# EAGLE design AudioAppBoard-0BAC0603 (EAGLE 5.10)
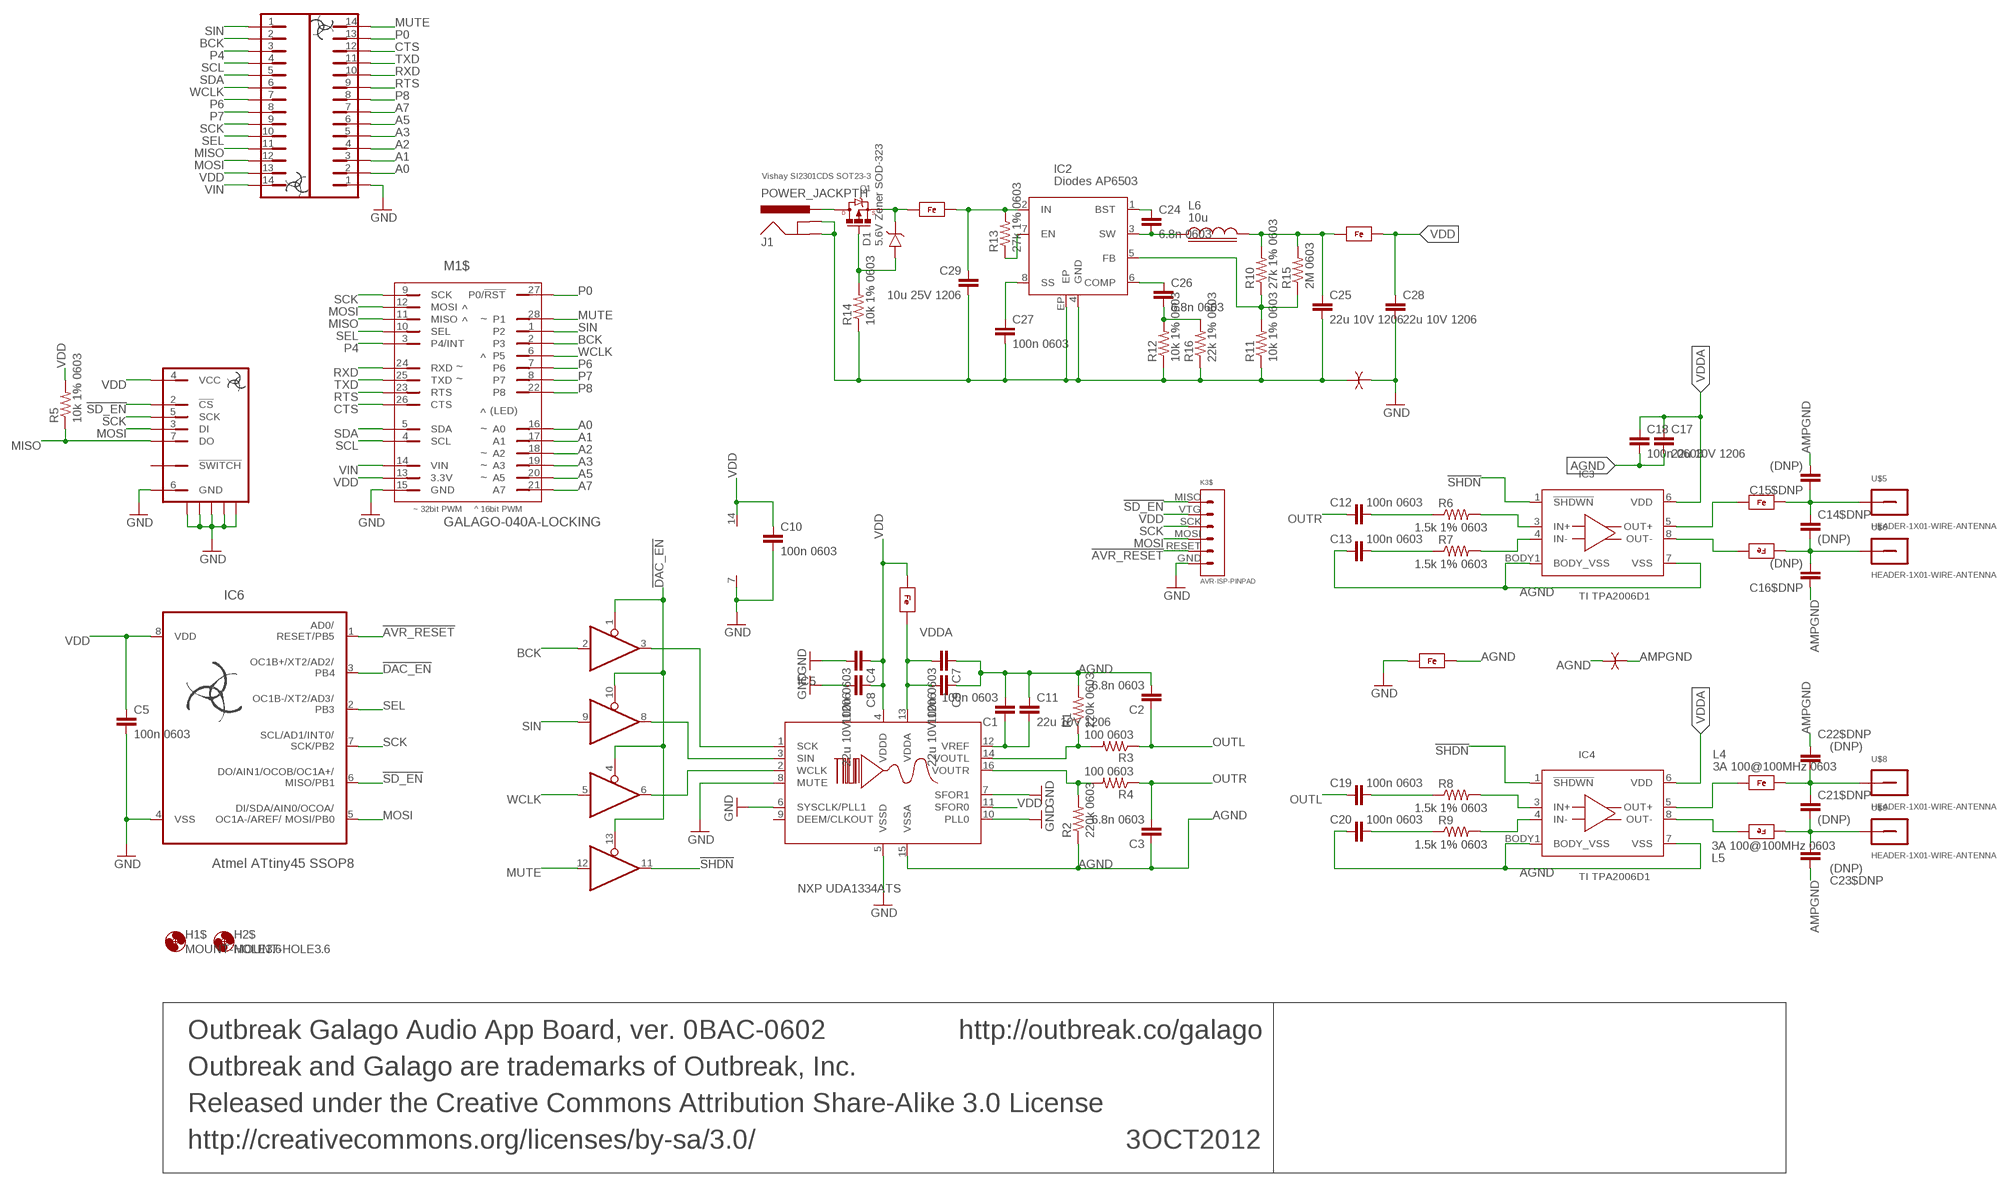
[diagram p0: schematic, sheet 1]

## Parts
3OCT2012  Outbreak Galago Audio App Board, ver. 0BAC-0602  INFO-BLOCK  [INFO-BLOCK]
C1  100n 0603  CAP-0603  [0603]
C2  6.8n 0603  CAP-0603  [0603]
C3  6.8n 0603  CAP-0603  [0603]
C4  100n 0603  CAP-0603  [0603]
C5  100n 0603  CAP-0603  [0603]
C7  100n 0603  CAP-0603  [0603]
C8  22u 10V 1206  CAP-1206  [1206]
C9  22u 10V 1206  CAP-1206  [1206]
C10  100n 0603  CAP-0603  [0603]
C11  22u 10V 1206  CAP-1206  [1206]
C12  100n 0603  CAP-0603-MIN  [0603-MIN]
C13  100n 0603  CAP-0603-MIN  [0603-MIN]
C14$DNP  (DNP)  CAP-0603-MIN  [0603-MIN]
C15$DNP  (DNP)  CAP-0603-MIN  [0603-MIN]
C16$DNP  (DNP)  CAP-0603-MIN  [0603-MIN]
C17  22u 10V 1206  CAP-1206  [1206]
C18  100n 0603  CAP-0603-MIN  [0603-MIN]
C19  100n 0603  CAP-0603-MIN  [0603-MIN]
C20  100n 0603  CAP-0603-MIN  [0603-MIN]
C21$DNP  (DNP)  CAP-0603-MIN  [0603-MIN]
C22$DNP  (DNP)  CAP-0603-MIN  [0603-MIN]
C23$DNP  (DNP)  CAP-0603-MIN  [0603-MIN]
C24  6.8n 0603  CAP-0603-MIN  [0603-MIN]
C25  22u 10V 1206  CAP-1206  [1206]
C26  6.8n 0603  CAP-0603-MIN  [0603-MIN]
C27  100n 0603  CAP-0603-MIN  [0603-MIN]
C28  22u 10V 1206  CAP-1206  [1206]
C29  10u 25V 1206  CAP-1206  [1206]
D1  5.6V Zener SOD-323  DIODE-ZENER-SOD323  [SOD-323]
FB1  3A 100@100MHz 0603  FERRITE-BEAD-0603-MIN  [0603-MIN]
FB2  3A 100@100MHz 0603  FERRITE-BEAD-0603  [0603]
FB3  800mA 60@100MHz 0603  FERRITE-BEAD-0603  [0603]
H1$  MOUNT-HOLE3.6  [3,6]
H2$  MOUNT-HOLE3.6  [3,6]
IC1  74HC125-TSSOP14  [TSSOP14]
IC2  Diodes AP6503  SWITCHING-REGULATOR-VARIABLE-BUCK-DIODES-AP6503  [EIAJ-SOIC8-3.9MM-EXPOSED-PAD]
IC3  TI TPA2006D1  AMP-AUDIO-CLASS-D-TI-TPA2006A  [QFN8-3X3MM-TI-TPA200X]
IC4  TI TPA2006D1  AMP-AUDIO-CLASS-D-TI-TPA2006A  [QFN8-3X3MM-TI-TPA200X]
IC5  NXP UDA1334ATS  AUDIO-DAC-NXP-UDA1334ATS  [TSSOP16]
IC6  Atmel ATtiny45 SSOP8  AVR-ATTINY25/45/85-TSSOP8  [TSSOP8]
J1  POWER_JACKPTH  [POWER_JACK_PTH]
K1$  HEADER-1X14-NO-SILK-CHUNKY  [HEADER-1X14-NO-SILK-CHUNKY]
K2$  HEADER-1X14-NO-SILK-CHUNKY  [HEADER-1X14-NO-SILK-CHUNKY]
K3$  AVR-ISP-PINPAD  [AVR-ISP-PINPAD]
L2  3A 100@100MHz 0603  FERRITE-BEAD-0603-MIN  [0603-MIN]
L3  3A 100@100MHz 0603  FERRITE-BEAD-0603-MIN  [0603-MIN]
L4  3A 100@100MHz 0603  FERRITE-BEAD-0603-MIN  [0603-MIN]
L5  3A 100@100MHz 0603  FERRITE-BEAD-0603-MIN  [0603-MIN]
L6  10u  INDUCTOR-6X6MM  [INDUCTOR-SMD-6X6MM]
L7  3A 100@100MHz 0603  FERRITE-BEAD-0603-MIN  [0603-MIN]
M1$  GALAGO-040A-LOCKING  [GALAGO-LOCKING]
Q1  Vishay SI2301CDS SOT23-3  MOSFET-P-CHANNEL-VISHAY-SI2301  [SOT23-3]
R1  220k 0603  RESISTOR-0603  [0603]
R2  220k 0603  RESISTOR-0603  [0603]
R3  100 0603  RESISTOR-0603  [0603]
R4  100 0603  RESISTOR-0603  [0603]
R5  10k 1% 0603  RESISTOR-0603-MIN  [0603-MIN]
R6  1.5k 1% 0603  RESISTOR-0603-MIN  [0603-MIN]
R7  1.5k 1% 0603  RESISTOR-0603-MIN  [0603-MIN]
R8  1.5k 1% 0603  RESISTOR-0603-MIN  [0603-MIN]
R9  1.5k 1% 0603  RESISTOR-0603-MIN  [0603-MIN]
R10  27k 1% 0603  RESISTOR-0603-MIN  [0603-MIN]
R11  10k 1% 0603  RESISTOR-0603-MIN  [0603-MIN]
R12  10k 1% 0603  RESISTOR-0603-MIN  [0603-MIN]
R13  27k 1% 0603  RESISTOR-0603-MIN  [0603-MIN]
R14  10k 1% 0603  RESISTOR-0603-MIN  [0603-MIN]
R15  2M 0603  RESISTOR-0603-MIN  [0603-MIN]
R16  22k 1% 0603  RESISTOR-0603-MIN  [0603-MIN]
U1$  GND-ISOLATOR-0.008"  [GND-ISOLATOR-0.008"]
U2$  GND-ISOLATOR-0.008"  [GND-ISOLATOR-0.008"]
U$2  SD-OR-MICROSD-SPI-MODE-WITH-SWITCH-HIROSE-DM3D-SF  [HIROSE-MICROSD-SOCKET-DM3D-SF]
U$5  HEADER-1X01-WIRE-ANTENNA  [HEADER-1X01-WIRE-ANTENNA]
U$6  HEADER-1X01-WIRE-ANTENNA  [HEADER-1X01-WIRE-ANTENNA]
U$8  HEADER-1X01-WIRE-ANTENNA  [HEADER-1X01-WIRE-ANTENNA]
U$9  HEADER-1X01-WIRE-ANTENNA  [HEADER-1X01-WIRE-ANTENNA]

## Nets
!AVR_RESET: IC6.1(RESET/PB5) K3$.RESET
!DAC_EN: IC1.1(EN) IC1.4(EN) IC1.10(EN) IC1.13(EN) IC6.3(PB4)
!SD_EN: IC6.6(MISO/PB1) K3$.MISO U$2.2(!CS)
!SHDN: IC1.11(Y) IC3.1(!SHDWN) IC4.1(!SHDWN)
A0: K1$.2 M1$.16(A0)
A1: K1$.3 M1$.17(A1)
A2: K1$.4 M1$.18(A2)
A3: K1$.5 M1$.19(A3)
A5: K1$.6 M1$.20(A5)
A7: K1$.7 M1$.21(A7)
AGND: C1.1 C2.1 C3.2 C7.2 C9.2 C11.2 C13.2 C17.1 C18.1 C20.2 IC3.7(VSS) IC3.BODY1(BODY_VSS) IC4.7(VSS) IC4.BODY1(BODY_VSS) IC5.15(VSSA) L7.2 R1.2 R2.1 U2$.1(A)
AMPGND: C15$DNP.1 C16$DNP.2 C22$DNP.1 C23$DNP.2 U2$.2(B)
BCK: IC1.2(A) K2$.2 M1$.2(P3)
CTS: K1$.12 M1$.26(CTS)
DAC_SCK: IC1.3(Y) IC5.1(SCK)
DAC_SIN: IC1.8(Y) IC5.3(SIN)
DAC_WCLK: IC1.6(Y) IC5.2(WCLK)
GND: C4.1 C5.1 C8.1 C10.1 C28.1 IC1.7(VSS) IC5.5(VSSD) IC5.6(SYSCLK/PLL1) IC5.7(SFOR1) IC5.8(MUTE) IC5.10(PLL0) IC6.4(VSS) K1$.1 K3$.GND L7.1 M1$.15(GND) U1$.2(B) U$2.6(GND) U$2.PP$1 U$2.PP$2 U$2.PP$3 U$2.PP$4 U$2.PP$5
MISO: K2$.11 M1$.11(MISO) R5.1 U$2.7(DO)
MOSI: IC6.5(MOSI/PB0) K2$.12 K3$.MOSI M1$.12(MOSI) U$2.3(DI)
MUTE: IC1.12(A) K1$.14 M1$.28(P1)
N$1: C14$DNP.2 C15$DNP.2 L2.2 U$5.1
N$2: IC4.5(OUT+) L4.1
N$3: IC3.5(OUT+) L2.1
N$4: IC3.8(OUT-) L3.2
N$5: C12.1 R6.1
N$6: D1.A Q1.1(GATE) R14.2
N$7: C13.1 R7.1
N$8: IC3.4(IN-) R7.2
N$9: IC3.3(IN+) R6.2
N$10: C14$DNP.1 C16$DNP.1 L3.1 U$6.1
N$11: IC4.8(OUT-) L5.2
N$12: C19.1 R8.1
N$13: C20.1 R9.1
N$14: IC4.4(IN-) R9.2
N$15: IC4.3(IN+) R8.2
N$18: C21$DNP.2 C22$DNP.2 L4.2 U$8.1
N$19: C21$DNP.1 C23$DNP.1 L5.1 U$9.1
N$23: D1.K FB1.1 Q1.2(SOURCE)
N$27: C26.1 R12.2 R16.2
N$31: J1.PWR Q1.3(DRAIN)
OUTL: C2.2 C19.2 R3.1
OUTR: C3.1 C12.2 R4.1
P0: K1$.13 M1$.27(P0/!RST)
P4: K2$.3 M1$.3(P4/INT)
P6: K2$.7 M1$.7(P6)
P7: K2$.8 M1$.8(P7)
P8: K1$.8 M1$.22(P8)
RTS: K1$.9 M1$.23(RTS)
RXD: K1$.10 M1$.24(RXD)
SCK: IC6.7(SCK/PB2) K2$.9 K3$.SCK M1$.9(SCK) U$2.5(SCK)
SCL: K2$.4 M1$.4(SCL)
SDA: K2$.5 M1$.5(SDA)
SEL: IC6.2(PB3) K2$.10 M1$.10(SEL)
SIN: IC1.9(A) K2$.1 M1$.1(P2)
SMPS-BST: C24.2 IC2.1(BST)
SMPS-COMP: C26.2 IC2.6(COMP)
SMPS-EN: IC2.7(EN) R13.1
SMPS-FB: IC2.5(FB) R10.1 R11.2 R15.1
SMPS-GND: C25.1 C27.1 C29.1 IC2.4(GND) IC2.EP J1.GND J1.GNDBREAK R11.1 R12.1 R14.1 R16.1 U1$.1(A)
SMPS-IN: C29.2 FB1.2 IC2.2(IN) R13.2
SMPS-OUT: C25.2 FB2.1 L6.2 R10.2 R15.2
SMPS-SS: C27.2 IC2.8(SS)
SMPS-SW: C24.1 IC2.3(SW) L6.1
TXD: K1$.11 M1$.25(TXD)
VDD: C4.2 C5.2 C8.2 C10.2 C28.2 FB2.2 FB3.1 IC1.14(VDD) IC5.4(VDDD) IC5.11(SFOR0) IC6.8(VDD) K2$.13 K3$.VTG M1$.13(3.3V) R5.2 U$2.4(VCC)
VDDA: C7.1 C9.1 C17.2 C18.2 FB3.2 IC3.6(VDD) IC4.6(VDD) IC5.13(VDDA)
VIN: K2$.14 M1$.14(VIN)
VOUTL: IC5.14(VOUTL) R1.1 R3.2
VOUTR: IC5.16(VOUTR) R2.2 R4.2
VREF: C1.2 C11.1 IC5.12(VREF)
WCLK: IC1.5(A) K2$.6 M1$.6(P5)
Unconnected: IC5.9(DEEM/CLKOUT) U$2.SWITCH(!SWITCH)

## Library data of the parts
3OCT2012 = Outbreak:INFO-BLOCK
C1-C5 C7-C13 C14$DNP C15$DNP C16$DNP C17-C20 C21$DNP C22$DNP C23$DNP C24-C29 = Outbreak:CAP
D1 = Outbreak:DIODE-ZENER
FB1-FB3 L2-L5 L7 = Outbreak:FERRITE-BEAD
H1$ H2$ = holes:MOUNT-HOLE: MOUNTING HOLE with drill center marker
IC1 = Outbreak:74HC125
IC2 = Outbreak:SWITCHING-REGULATOR-VARIABLE-BUCK-DIODES-AP6503
IC3 IC4 = Outbreak:AMP-AUDIO-CLASS-D-TI-TPA2006A
IC5 = Outbreak:AUDIO-DAC-NXP-UDA1334ATS
IC6 = Outbreak:AVR-ATTINY25/45/85
J1 = SparkFun:POWER_JACK: Power Jack This is the standard 5.5mm barrel jack for power. The PTH is the most common, proven, reliable, footprint. All others are experimental. The Slot footprint only works if the mill layer is transmitted to the PCB fab house so be warned. Spark Fun Electronics SKU : PRT-00119. Mating wall wart : TOL-00298 (and others)
K1$ K2$ = Outbreak:HEADER-1X14-NO-SILK
K3$ = Outbreak:AVR-ISP-PINPAD
L6 = Outbreak:INDUCTOR
M1$ = Outbreak-v0:GALAGO-040A
Q1 = Outbreak:MOSFET-P-CHANNEL
R1-R16 = Outbreak:RESISTOR: Resistor Basic schematic elements and footprints for 0603, 1206, and PTH resistors.
U1$ U2$ = Outbreak:GND-ISOLATOR
U$2 = Outbreak:SD-OR-MICROSD-SPI-MODE-WITH-SWITCH
U$5 U$6 U$8 U$9 = Outbreak:HEADER-1X01

## Board
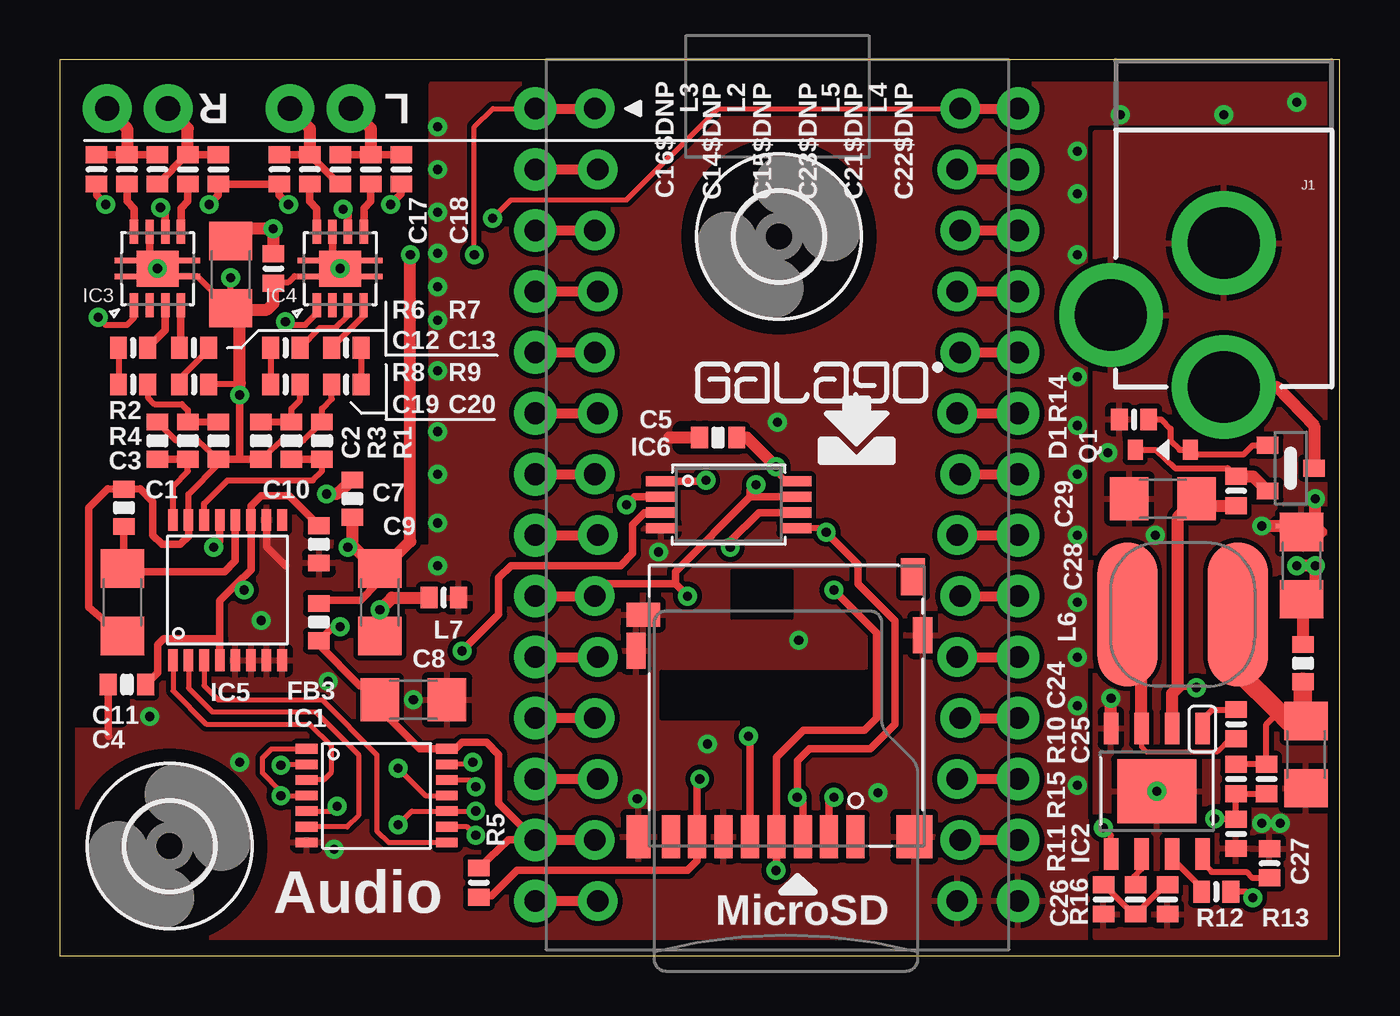
[diagram p1: board, top side]
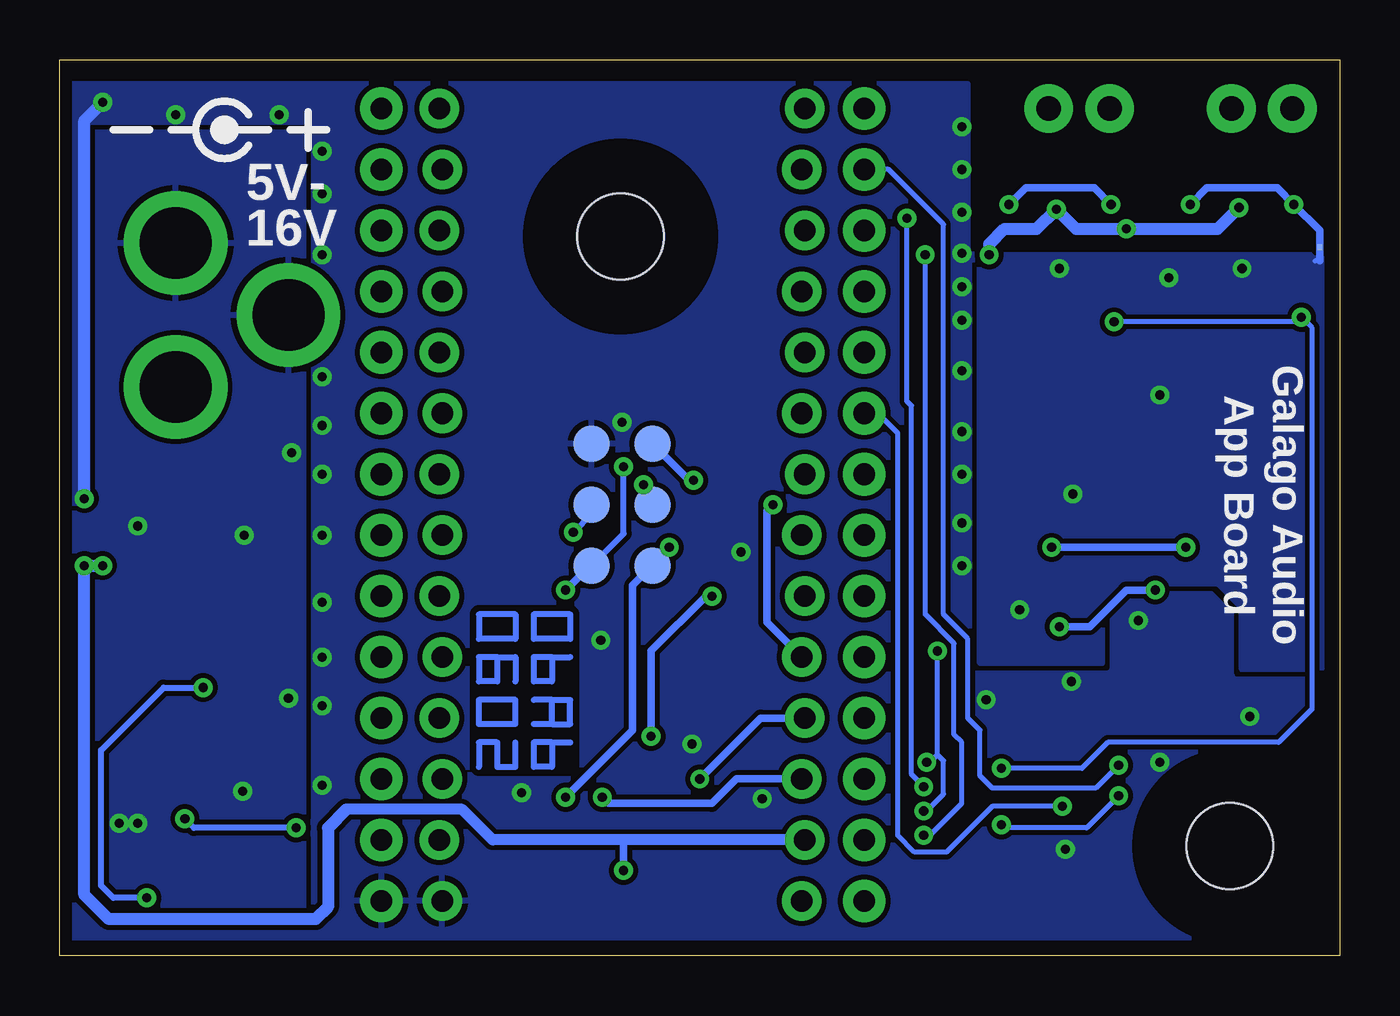
[diagram p2: board, bottom side, seen from below]

Size 53.34 x 37.33 mm. Coordinates in mm from the lower left corner, seen from the top.
Outline: 0,0 53.34,0 53.34,37.33 0,37.33 0,0
Copper layers (1*16): Top 0.035mm / dielectric 1.5mm / Bottom 0.035mm
Design rules "default *": minimum track width 8mil, minimum drill 15mil, track to track 8mil, track to pad 8mil, pad to pad 8mil, via to via 8mil, smd to smd 8mil, copper to edge 20mil, drill to drill 8mil, minimum pad ring 10mil, minimum via ring 8mil, stop-mask expansion 4mil, vias tented up to drill 20mil, thermal gap 10mil
tRestrict: area 25.9,21.3 to 28.3,21.9; area 0.5,9.9 to 2.5,11.7
bRestrict: area 32.1,7.9 to 35.9,14.2

### Footprints (pad centres in the part's own frame; a part is rotated, then mirrored left to right if it is on the bottom)
0603 = smd 0.7 x 0.9: 1 -0.777,0; 2 0.777,0
1206 = smd 1.6 x 1.8: 1 -1.4,0; 2 1.4,0
0603-MIN = smd 0.7 x 0.9: 1 -0.61,0; 2 0.61,0
SOD-323 = smd 0.63 x 0.83: A -1.15,0; K 1.15,0
3,6 = hole 3.6: 0,0
TSSOP14 = smd 0.4 x 0.9: 1 2.275,2.925; 2 1.625,2.925; 3 0.975,2.925; 4 0.325,2.925; 5 -0.325,2.925; 6 -0.975,2.925; 7 -1.625,2.925; 8 -1.625,-2.925; 9 -0.975,-2.925; 10 -0.325,-2.925; 11 0.325,-2.925; 12 0.975,-2.925; 13 1.625,-2.925; 14 2.275,-2.925
EIAJ-SOIC8-3.9MM-EXPOSED-PAD = smd 1.321 x 0.61: 1 -2.618,1.905; 2 -2.618,0.635; 3 -2.618,-0.635; 4 -2.618,-1.905; 5 2.618,-1.905; 6 2.618,-0.635; 7 2.618,0.635; 8 2.618,1.905 | smd 2.66 x 3.3: EP 0,0
QFN8-3X3MM-TI-TPA200X = smd 0.35 x 1: 1 0.975,1.525; 2 0.325,1.525; 3 -0.325,1.525; 4 -0.975,1.525; 5 -0.985,-1.525; 6 -0.325,-1.525; 7 0.325,-1.525; 8 0.975,-1.525 | smd 1.75 x 1.5: BODY1 0,0 | smd 0.9 x 0.23: BODY2 -1.325,0.325; BODY3 -1.325,-0.325; BODY4 1.325,-0.325; BODY5 1.325,0.325
TSSOP16 = smd 0.4 x 0.9: 1 2.275,2.925; 2 1.625,2.925; 3 0.975,2.925; 4 0.325,2.925; 5 -0.325,2.925; 6 -0.975,2.925; 7 -1.625,2.925; 8 -2.275,2.925; 9 -2.275,-2.925; 10 -1.625,-2.925; 11 -0.975,-2.925; 12 -0.325,-2.925; 13 0.325,-2.925; 14 0.975,-2.925; 15 1.625,-2.925; 16 2.275,-2.925
TSSOP8 = smd 1.25 x 0.42: 1 -2.825,0.975; 2 -2.825,0.325; 3 -2.825,-0.325; 4 -2.825,-0.975; 5 2.825,-0.975; 6 2.825,-0.325; 7 2.825,0.325; 8 2.825,0.975
POWER_JACK_PTH = drill 2.997 pad 4.318 round: GND 0,7.7; GNDBREAK 4.7,10.7; PWR 0,13.7
HEADER-1X14-NO-SILK-CHUNKY = drill 0.9 pad 1.778 round: 1 0,0; 2 2.54,0; 3 5.08,0; 4 7.62,0; 5 10.16,0; 6 12.7,0; 7 15.24,0; 8 17.78,0; 9 20.32,0; 10 22.86,0; 11 25.4,0; 12 27.94,0; 13 30.48,0; 14 33.02,0
AVR-ISP-PINPAD = smd 1.524 x 1.524: GND 2.54,1.27; MISO -2.54,-1.27; MOSI 0,1.27; RESET 2.54,-1.27; SCK 0,-1.27; VTG -2.54,1.27
INDUCTOR-SMD-6X6MM = smd 2.5 x 6: 1 -2.3,0; 2 2.3,0
GALAGO-LOCKING = drill 0.9 pad 1.651 round: 1 -7.62,16.51; 2 -7.493,13.97; 3 -7.62,11.43; 4 -7.493,8.89; 5 -7.62,6.35; 6 -7.493,3.81; 7 -7.62,1.27; 8 -7.493,-1.27; 9 -7.62,-3.81; 10 -7.493,-6.35; 11 -7.62,-8.89; 12 -7.493,-11.43; 13 -7.62,-13.97; 14 -7.493,-16.51; 15 7.493,-16.51; 16 7.62,-13.97; 17 7.493,-11.43; 18 7.62,-8.89; 19 7.493,-6.35; 20 7.62,-3.81; 21 7.493,-1.27; 22 7.62,1.27; 23 7.493,3.81; 24 7.62,6.35; 25 7.493,8.89; 26 7.62,11.43; 27 7.493,13.97; 28 7.62,16.51
SOT23-3 = smd 0.7 x 0.9: 1 0.95,0.97; 2 -0.95,0.97; 3 0,-0.97
GND-ISOLATOR-0.008" = smd 0.203 x 0.203: 1 -0.025,0; 2 0.025,0
HIROSE-MICROSD-SOCKET-DM3D-SF = smd 0.75 x 1.8: 1 2.62,-4.18; 2 1.52,-4.18; 3 0.42,-4.18; 4 -0.68,-4.18; 5 -1.78,-4.18; 6 -2.88,-4.18; 7 -3.98,-4.18; 8 -5.08,-4.18 | smd 1.4 x 1: PP$1 -6.23,5.07 | smd 0.8 x 1.5: PP$2 -6.53,3.57; PP$5 5.42,4.22 | smd 1 x 1.8: PP$3 -6.43,-4.18 | smd 1.5 x 1.8: PP$4 5.07,-4.18 | smd 1 x 1.55: SWITCH 5.02,6.645
HEADER-1X01-WIRE-ANTENNA = drill 1.016 pad 2.032 round: 1 0,0

### Placement (x,y rotation side)
3OCT2012  6.1,-7.62 0 top  (outside the outline)
C1  2.67,18.67 270 top
C2  8.38,21.46 90 top
C3  6.6,21.46 270 top
C4  2.79,11.3 0 top
C5  27.43,21.59 0 top
C7  12.19,19.05 90 top
C8  14.73,10.67 180 top
C9  13.34,14.73 270 top
C10  10.79,17.14 90 top
C11  2.6,14.73 270 top
C12  3.05,23.81 0 top
C13  5.59,23.81 0 top
C14$DNP  4.06,32.77 270 top
C15$DNP  6.6,32.77 90 top
C16$DNP  1.52,32.77 270 top
C17  7.11,28.38 90 top
C18  8.89,28.64 90 top
C19  9.4,23.81 0 top
C20  11.94,23.81 180 top
C21$DNP  11.68,32.77 90 top
C22$DNP  14.22,32.77 90 top
C23$DNP  9.14,32.77 270 top
C24  49.02,9.65 90 top
C25  51.94,8.38 90 top
C26  44.83,2.35 90 top
C27  50.42,3.85 270 top
C28  51.75,16.26 270 top
C29  45.97,19.05 0 top
D1  45.97,21.08 180 top
FB1  49.02,19.37 270 top
FB2  51.82,12.19 90 top
FB3  10.79,13.91 90 top
H1$  29.97,29.97 0 top
H2$  4.57,4.57 0 top
IC1  13.21,6.35 90 top
IC2  45.72,6.86 270 top
IC3  4.06,28.64 180 top
IC4  11.68,28.64 180 top
IC5  6.99,15.24 180 top
IC6  27.88,18.8 0 top
J1  48.51,37.4 180 top
K1$  39.94,2.29 90 top
K2$  19.81,35.31 270 top
K3$  29.91,18.8 90 bottom
L2  5.33,32.77 90 top
L3  2.79,32.77 270 top
L4  12.95,32.77 90 top
L5  10.41,32.77 270 top
L6  46.8,14.22 0 top
L7  16,14.92 180 top
M1$  29.91,18.8 0 top
Q1  51.31,20.32 90 top
R1  10.92,21.46 90 top
R2  4.06,21.46 270 top
R3  9.65,21.46 270 top
R4  5.33,21.46 270 top
R5  17.46,3.05 90 top
R6  3.05,25.34 0 top
R7  5.59,25.34 180 top
R8  9.4,25.34 0 top
R9  11.94,25.34 180 top
R10  49.02,7.37 90 top
R11  49.02,5.08 90 top
R12  46.16,2.35 90 top
R13  48.2,2.67 0 top
R14  44.77,22.35 0 top
R15  50.29,7.37 90 top
R16  43.5,2.35 90 top
U1$  50.8,17.91 0 top
U2$  0.83,29.53 90 bottom
U$1  [GALAGO-LOGO]  31.43,23.88 0 top
U$2  30.54,9.14 0 top
U$3  [GALAGO-APP-BOARD-SYMBOL]  33.21,21.34 0 top
U$5  4.51,35.31 0 top
U$6  1.97,35.31 0 top
U$8  12.13,35.31 0 top
U$9  9.59,35.31 0 top

### Tracks (layer width: path | path; a pad name or v marks a point on that pad's centre or on a via)
!AVR_RESET  (via drill 0.38)
  Top 0.305: v26.92,19.81 26.88,19.77 IC6.1
  Bottom 0.305: K3$.RESET 27.11,19.81 v26.92,19.81
!DAC_EN  (via drill 0.38)
  Top 0.203: IC1.4 9.28,6.67 v9.21,6.67 9.21,6.86 8.45,7.62 8.45,8.26 8.82,8.62 IC1.1 | v17.34,6.03 17.33,6.03 IC1.10 14.66,6.03 v14.1,5.46 | IC1.13 17.12,7.97 v17.21,8.06
  Top 0.305: IC6.3 24.38,18.47 23.88,17.97 23.88,16.76 23.37,16.26 18.8,16.26 18.29,15.75 18.29,14.22 v16.76,12.7
  Bottom 0.203: v14.1,5.46 13.97,5.33 10.54,5.33 v9.21,6.67 | 16.76,8.38 v16.76,12.7 | 16.76,8.38 16.51,8.13 16.51,6.73 17.21,6.03 v17.34,6.03 | v17.21,8.06 17.08,8.06 16.76,8.38
!SD_EN  (via drill 0.38)
  Top 0.305: U$2.2 32.06,6.41 v32.26,6.6 | v27.94,17.02 27.94,17.27 29.14,18.47 IC6.6
  Bottom 0.305: v32.26,6.6 29.46,9.4 29.46,15.43 K3$.MISO 28.64,16.32 v27.94,17.02
!SHDN  (via drill 0.38)
  Top 0.203: IC1.11 15.23,6.67 v14.1,7.81
  Top 0.254: IC3.1 3.09,26.58 2.79,26.29 1.91,26.29 v1.59,26.61 | IC4.1 10.71,26.77 10.22,26.29 9.53,26.29 v9.4,26.42
  Bottom 0.203: v9.4,26.42 1.78,26.42 v1.59,26.61 1.14,26.16 1.14,10.29 2.54,8.89 9.65,8.89 10.73,7.81 v14.1,7.81
A0
  Top 0.406: M1$.16 K1$.2
A1
  Top 0.406: M1$.17 K1$.3
A2
  Top 0.406: M1$.18 K1$.4
A3
  Top 0.406: M1$.19 K1$.5
A5
  Top 0.406: M1$.20 K1$.6
A7
  Top 0.406: M1$.21 K1$.7
AGND  (via drill 0.38)
  Top 0.254: C2.1 9.23,21.46 10.14,21.46 R1.2 10.92,22.8 11.33,23.2 C20.2 | R2.1 4.84,21.46 5.75,21.46 C3.2 6.6,20.49 5.36,19.24 IC5.15 | C13.2 7.49,23.81 7.49,23.88 | IC3.BODY1 4.38,28.32 5.71,28.32 7.05,26.98 C17.1 | IC4.BODY1 11.37,28.32 9.78,28.32 9.53,28.07 8.89,28.07 C18.1 | 7.11,27.37 v7.11,28.26
  Top 0.305: IC3.7 3.74,28.96 IC3.BODY1 | IC4.7 11.36,28.96 IC4.BODY1 | C11.2 1.21,14.53 1.21,18.67 1.99,19.46 C1.1 3.34,19.46 3.87,18.92 3.87,17.53 4.25,17.14 5.02,17.14 5.36,17.49 IC5.15 | C3.2 7.49,20.69 | 7.49,20.69 C2.1 | 7.49,20.69 v7.49,23.37
  Top 0.508: C18.1 8.89,27.18 8.64,26.92 7.49,26.92 | C17.1 7.11,26.92 7.49,26.92 | v7.49,23.37 7.49,23.88 7.49,26.92 | v11.11,19.24 11.53,19.24 C7.2 | C9.2 v13.34,14.41 13.84,14.92 L7.2
  Bottom 0.203: 0.83,28.96 1.02,28.96
  Bottom 0.305: U2$.1 0.83,28.96
  other vias: 4.06,28.64 11.68,28.64
  pour Bottom: 0.76,29.21 0.76,11.94 4.06,11.94 4.06,14.48 5.08,15.49 8.89,15.49 9.91,14.48 9.91,12.19 14.99,12.19 14.99,29.21
AMPGND  (via drill 0.38)
  Top 0.305: v6.22,31.3 6.6,31.69 C15$DNP.1 C23$DNP.2 9.14,31.69 v9.53,31.3 | C16$DNP.2 1.52,31.69 v1.91,31.3 | C22$DNP.1 14.22,31.75 v13.78,31.3
  Bottom 0.203: v1.91,31.3 1.91,31.37
  Bottom 0.305: v6.22,31.3 5.52,32 2.6,32 v1.91,31.3 0.83,30.23 U2$.2 | v13.78,31.3 13.08,32 10.22,32 v9.53,31.3
BCK  (via drill 0.38)
  Top 0.203: IC1.2 9.24,7.97 v9.21,7.94
  Top 0.406: K2$.2 M1$.2
  Bottom 0.203: v9.21,7.94 10.16,6.99 14.48,6.99 14.99,7.49 14.99,9.4 15.49,9.91 15.49,13.21 16.51,14.22 16.51,30.48 18.8,32.77 K2$.2
CTS
  Top 0.406: M1$.26 K1$.12
DAC_SCK
  Top 0.203: IC1.3 11.01,7.33 11.3,7.62 11.3,8.76 10.41,9.65 6.1,9.65 4.71,11.04 IC5.1
DAC_SIN
  Top 0.203: IC5.3 6.01,11.26 6.6,10.67 10.92,10.67 13.21,8.38 13.21,5.21 13.69,4.72 IC1.8
DAC_WCLK
  Top 0.203: IC1.6 11.98,5.38 12.45,5.84 12.45,8.38 10.67,10.16 6.35,10.16 5.36,11.15 IC5.2
GND  (via drill 0.38)
  Top 0.305: IC5.10 8.61,17.04 9.4,16.26 | C4.1 2.02,9.16 2.03,9.14
  Top 0.508: 52.07,17.91 U1$.2 | 52.07,17.91 C28.1 52.58,17.66 | 52.07,17.91 52.32,17.91 v52.32,19.05 | C5.1 25.4,21.59
  Bottom 0.508: v52.32,19.05 52.32,34.8 v51.56,35.56
  other vias: 8.38,13.97 3.75,9.97 14.73,10.67 11.43,4.45 24.07,6.54 26.99,8.83 30.8,13.14 29.91,22.23 24.96,16.83 34.1,6.79 15.75,34.54 15.75,32.77 15.75,29.27 15.75,26.48 15.75,24.38 15.75,21.84 15.75,20.07 15.75,16.26 15.75,30.99 15.75,27.88 15.75,18.03 11.18,11.43 7.49,8.06 42.42,7.11 42.42,10.41 42.42,12.45 42.42,24.13 42.42,22.1 42.42,20.07 42.42,17.53 42.42,14.73 42.42,29.21 42.42,31.75 42.42,33.53 44.2,35.05 48.51,35.05
  pour Top (rank 2): 15.49,36.32 52.83,36.32 52.83,0.76 0.76,0.76 0.76,10.92 3.81,10.92 3.81,14.48 1.02,14.48 1.02,19.05 12.19,19.05 12.19,17.02 15.49,17.02
  pour Bottom (rank 2): 0.76,29.21 15.49,29.21 15.49,36.32 52.83,36.32 52.83,0.76 0.76,0.76
MISO  (via drill 0.38)
  Top 0.305: v26.67,7.37 26.56,7.26 U$2.7 26.56,3.96 26.16,3.56 19.05,3.56 17.99,2.5 R5.1
  Top 0.406: M1$.11 K2$.11
  Bottom 0.305: v26.67,7.37 24.13,9.91 M1$.11
MOSI  (via drill 0.38)
  Top 0.254: v31.94,17.65 31.77,17.82 IC6.5
  Top 0.305: U$2.3 30.96,6.38 v30.73,6.6 30.73,8.13 31.24,8.64 33.78,8.64 34.8,9.65 34.8,13.97 33.27,15.49 33.27,16.32 v31.94,17.65
  Top 0.406: K2$.12 M1$.12
  Bottom 0.254: K3$.MOSI 31.18,18.41 v31.94,17.65
  Bottom 0.305: v30.73,6.6 30.48,6.35 26.16,6.35 25.15,7.37 M1$.12 22.29,7.37
MUTE  (via drill 0.38)
  Top 0.203: v18.03,30.73 18.8,31.5 23.62,31.5 27.43,35.31 M1$.28 | IC1.12 17.06,7.33 v17.34,7.05
  Top 0.406: M1$.28 K1$.14
  Bottom 0.203: v17.34,7.05 17.84,7.56 17.84,22.92 18.03,23.11 v18.03,30.73
N$1
  Top 0.305: C14$DNP.2 5.28,33.38 L2.2 C15$DNP.2
  Top 0.508: U$5.1 5.33,34.48 L2.2
N$2
  Top 0.305: IC4.5 12.67,31.15 12.95,31.43 L4.1
N$3
  Top 0.305: IC3.5 5.05,31.15 5.33,31.43 L2.1
N$4
  Top 0.305: IC3.8 3.09,31.14 2.79,31.43 L3.2
N$5
  Top 0.254: R6.1 C12.1
N$6
  Top 0.254: Q1.1 49.72,21.27 49.34,20.89 47.24,20.89 | D1.A 46.67,21.08 46.29,21.46 46.29,21.97 45.91,22.35 R14.2
  Top 0.305: 47.24,20.89 47.12,20.89 D1.A
N$7
  Top 0.254: R7.1 6.2,25.25 4.98,24.03 C13.1
N$8
  Top 0.305: IC3.4 5.04,25.59 R7.2
N$9
  Top 0.305: IC3.3 4.39,26.07 R6.2
N$10
  Top 0.305: C16$DNP.1 L3.1 C14$DNP.1
  Top 0.508: U$6.1 2.79,34.48 L3.1
N$11
  Top 0.305: IC4.8 10.71,31.14 10.41,31.43 L5.2
N$12
  Top 0.254: R8.1 C19.1
N$13
  Top 0.254: R9.1 C20.1
N$14
  Top 0.254: R9.2 12.66,26.67 IC4.4
N$15
  Top 0.254: R8.2 10.83,26.16 11.49,26.16 12.01,26.68 IC4.3
N$16
  Bottom 0.254: 32.07,14.22 32.07,13.21 33.59,13.21 33.59,14.22 32.07,14.22
N$17
  Bottom 0.254: 32.83,12.45 33.59,12.45 33.59,11.43 32.83,11.43 32.83,12.45 | 32.83,12.45 32.07,12.45
N$18
  Top 0.305: C21$DNP.2 L4.2 C22$DNP.2
  Top 0.508: U$8.1 12.95,34.48 L4.2
N$19
  Top 0.305: C23$DNP.1 L5.1 11.63,32.16 C21$DNP.1
  Top 0.508: U$9.1 10.41,34.48 L5.1
N$20
  Bottom 0.254: 32.83,9.65 32.07,9.65 32.07,10.67 32.83,10.67 | 32.83,9.65 33.59,9.65 | 32.83,10.67 33.59,10.67 | 32.83,9.65 32.83,10.67
N$21
  Bottom 0.254: 32.83,8.89 33.59,8.89 33.59,7.87 32.83,7.87 32.83,8.89 | 32.83,8.89 32.07,8.89
N$22
  Bottom 0.254: 34.35,14.22 34.35,13.21 35.88,13.21 35.88,14.22 34.35,14.22
N$23
  Top 0.254: D1.K 45.66,21.08 46.48,20.32 48.68,20.32 FB1.1
  Top 0.508: Q1.2 49.73,19.98 FB1.1
N$24
  Bottom 0.254: 34.35,11.43 34.35,12.45 35.12,12.45 | 35.12,12.45 35.88,12.45 35.88,11.43 35.12,11.43 35.12,12.45
N$25
  Bottom 0.254: 34.35,9.65 34.35,10.67 35.88,10.67 35.88,9.65 34.35,9.65
N$26
  Bottom 0.254: 34.35,8.89 34.35,7.87 35.12,7.87 35.12,8.89 35.88,8.89 35.88,7.87
N$27
  Top 0.254: R16.2 43.52,2.96 44.74,1.74 C26.1 44.86,1.74 46.08,2.96 R12.2
N$31
  Top 0.508: J1.PWR 50.72,23.7 52.28,22.08 Q1.3
OUTL
  Top 0.254: R3.1 9.65,22.8 10.01,23.15 C19.2
  Top 0.305: R3.1 C2.2
OUTR
  Top 0.254: C12.2 3.66,23.27 3.94,22.99 5.08,22.99 5.33,22.73 R4.1
  Top 0.305: R4.1 C3.1
P0
  Top 0.406: M1$.27 K1$.13
P4
  Top 0.406: K2$.3 M1$.3
P6
  Top 0.406: K2$.7 M1$.7
P7
  Top 0.406: K2$.8 M1$.8
P8
  Top 0.406: M1$.22 K1$.8
RTS
  Top 0.406: M1$.23 K1$.9
RXD
  Top 0.406: M1$.24 K1$.10
SCK  (via drill 0.38)
  Top 0.305: U$2.5 28.76,9.08 v28.7,9.14 | 25.65,15.49 v26.16,14.99 | 25.65,15.49 22.8,15.49 M1$.9 | 28.77,19.12 IC6.7 | 28.77,19.12 25.65,16 25.65,15.49 | 28.77,19.12 28.77,19.38 v29.02,19.62
  Top 0.406: K2$.9 M1$.9
  Bottom 0.305: v28.7,9.14 28.7,12.7 26.42,14.99 v26.16,14.99 | K3$.SCK 28.64,19.24 v29.02,19.62
SCL
  Top 0.406: K2$.4 M1$.4
SDA
  Top 0.406: K2$.5 M1$.5
SEL  (via drill 0.38)
  Top 0.305: IC6.2 23.95,19.12 v23.62,18.8
  Top 0.406: K2$.10 M1$.10
  Bottom 0.305: v23.62,18.8 23.88,18.54 23.88,13.91 M1$.10
SIN  (via drill 0.38)
  Top 0.203: v17.27,29.21 17.27,34.54 18.03,35.31 K2$.1 | IC1.9 16.98,5.38 v17.34,5.02
  Top 0.406: K2$.1 M1$.1
  Bottom 0.203: v17.27,29.21 17.27,14.22 16.07,13.02 16.07,9.21 15.75,8.89 15.75,6.35 17.08,5.02 v17.34,5.02
SMPS-BST
  Top 0.254: IC2.1 47.62,9.84 48.04,10.26 C24.2
SMPS-COMP
  Top 0.254: IC2.6 45.09,3.62 44.77,3.3 C26.2
SMPS-EN
  Top 0.254: IC2.7 46.35,4.06 47.59,2.83 R13.1
SMPS-FB  (via drill 0.38)
  Top 0.254: v48.13,5.71 49.02,5.71 R11.2 R10.1 R15.1 | IC2.5 43.81,5.02 v43.5,5.33
  Bottom 0.254: v48.13,5.71 47.75,5.33 v43.5,5.33
SMPS-GND  (via drill 0.38)
  Top 0.508: IC2.4 v43.81,10.73 | 45.47,6.86 IC2.EP | U1$.1 v50.1,17.91
  other vias: 45.66,17.53 45.72,6.86 50.1,5.52 43.69,20.95 50.86,5.52
  pour Top: 43.18,34.29 52.83,34.29 52.83,0.76 43.18,0.76
  pour Bottom: 43.18,34.29 52.83,34.29 52.83,0.76 43.18,0.76
SMPS-IN  (via drill 0.38)
  Top 0.203: v47.37,11.18 46.61,11.18
  Top 0.254: R13.2 49.47,2.67 v49.72,2.41
  Top 0.508: FB1.2 47.37,18.76 C29.2 46.61,18.29 46.61,11.18 46.35,10.92 IC2.2
  Bottom 0.254: v49.72,2.41 51.12,2.41 51.63,2.92 51.63,8.57 49.02,11.18 v47.37,11.18
SMPS-OUT
  Top 0.254: R10.2 R15.2 50.29,9.65 50.8,10.16
  Top 0.762: L6.2 49.1,11.86 50.8,10.16 51.18,9.78 51.82,9.78 | 51.82,9.78 C25.2 | 51.82,9.78 FB2.1
SMPS-SS
  Top 0.254: IC2.8 47.62,3.87 48.01,3.49 49.47,3.49 49.71,3.25 C27.2
SMPS-SW
  Top 0.203: IC2.3 45.09,8.7 45.28,8.51 48.26,8.51 48.79,9.04 C24.1
  Top 0.508: IC2.3 45.09,14.22 L6.1
TXD
  Top 0.406: M1$.25 K1$.11
VDD  (via drill 0.38)
  Top 0.254: v29.84,20.38 29.84,20.19 30.27,19.77 IC6.8
  Top 0.305: C10.2 9.55,19.18 8.38,19.18 7.96,18.75 IC5.11 7.96,16.09 7.37,15.49 | FB3.1 10.54,13.12 | C4.2 4.06,11.79 4.06,12.95 4.32,13.21 6.66,13.21 | FB3.1 10.79,12.95 12.5,11.25 13.45,11.25 C8.2 13.26,10.36 15,8.62 IC1.14 16.5,8.62 16.76,8.89 17.78,8.89 18.29,8.38 18.29,6.35 K2$.13 18.69,4.83 R5.2 | 7.37,15.49 6.66,14.79 6.66,13.21 | 6.66,13.21 IC5.4 | v7.68,15.24 7.43,15.49 7.37,15.49 | v11.68,13.72 11.39,13.72 FB3.1 | v29.84,3.56 29.86,3.58 U$2.4 29.86,8.27 30.99,9.4 33.53,9.4 34.04,9.91 34.04,13.46 v32.26,15.24
  Top 0.406: K2$.13 M1$.13
  Top 0.508: FB2.2 51.82,14.86 C28.2 52.32,14.86 v52.32,16.26 v51.56,16.26 | C5.2 28.64,21.59 v29.84,20.38
  Bottom 0.254: K3$.VTG 29.84,17.59 v29.84,20.38
  Bottom 0.305: v7.68,15.24 8.89,15.24 10.41,13.72 v11.68,13.72 | 29.84,4.83 v29.84,3.56 | v32.26,15.24 31.24,16.26 K3$.VTG
  Bottom 0.457: M1$.13 29.84,4.83 35.31,4.83 36.58,6.1 41.4,6.1
  Bottom 0.508: 41.4,6.1 42.16,5.33 42.16,2.03 42.67,1.52 51.31,1.52 52.32,2.54 v52.32,16.26 v51.56,16.26
VDDA  (via drill 0.38)
  Top 0.305: IC5.13 6.66,17.27 v6.41,17.02 | 13.21,16.33 12.95,16.33 12.69,16.33 | 13.21,16.33 C9.1 | 13.21,16.33 13.21,15.49 12.53,14.82 10.79,14.82 FB3.2 | IC3.6 4.39,30.98 v4.19,31.18 | IC4.6 12.01,30.92 v11.81,31.11
  Top 0.508: C17.2 7.11,30.29 v8.89,30.29 C18.2 | C9.1 13.66,16.33 14.61,17.27 v14.61,29.21 | 12.95,16.33 12.27,17.02 v12,17.02 12.19,17.21 C7.1
  Bottom 0.305: v6.41,17.02 v12,17.02
  Bottom 0.508: v4.19,31.18 5.08,30.29 v8.89,30.29 10.99,30.29 v11.81,31.11 12.64,30.29 13.97,30.29 14.61,29.65 v14.61,29.21
VIN
  Top 0.406: K2$.14 M1$.14
VOUTL
  Top 0.254: R1.1 10.92,20.19 10.54,19.81 6.99,19.81 6.01,18.84 IC5.14
  Top 0.305: R1.1 R3.2
VOUTR
  Top 0.254: R4.2 5.33,20.19 4.71,19.57 IC5.16
  Top 0.305: R4.2 R2.2
VREF
  Top 0.305: IC5.12 7.31,16.45 6.86,16 2.54,16 C11.1 2.67,16.33 C1.2
WCLK  (via drill 0.38)
  Top 0.203: IC1.5 11.36,6.03 v11.56,6.22
  Top 0.406: K2$.6 M1$.6
  Bottom 0.203: K2$.6 19.24,22.61 18.41,21.78 18.41,5.02 17.72,4.32 16.38,4.32 14.48,6.22 v11.56,6.22

### Text on the board
tPlace: R | L | Audio | MicroSD
bPlace: 5V- | 16V | Galago Audio | App Board